# EasyEDA schematic Music Player Module.json
TITLE: Sheet_1; REV: 1.0; Date: 2022-03-27; Sheet: 1/1; Drawn By: confusedtx5; Company: Your Company
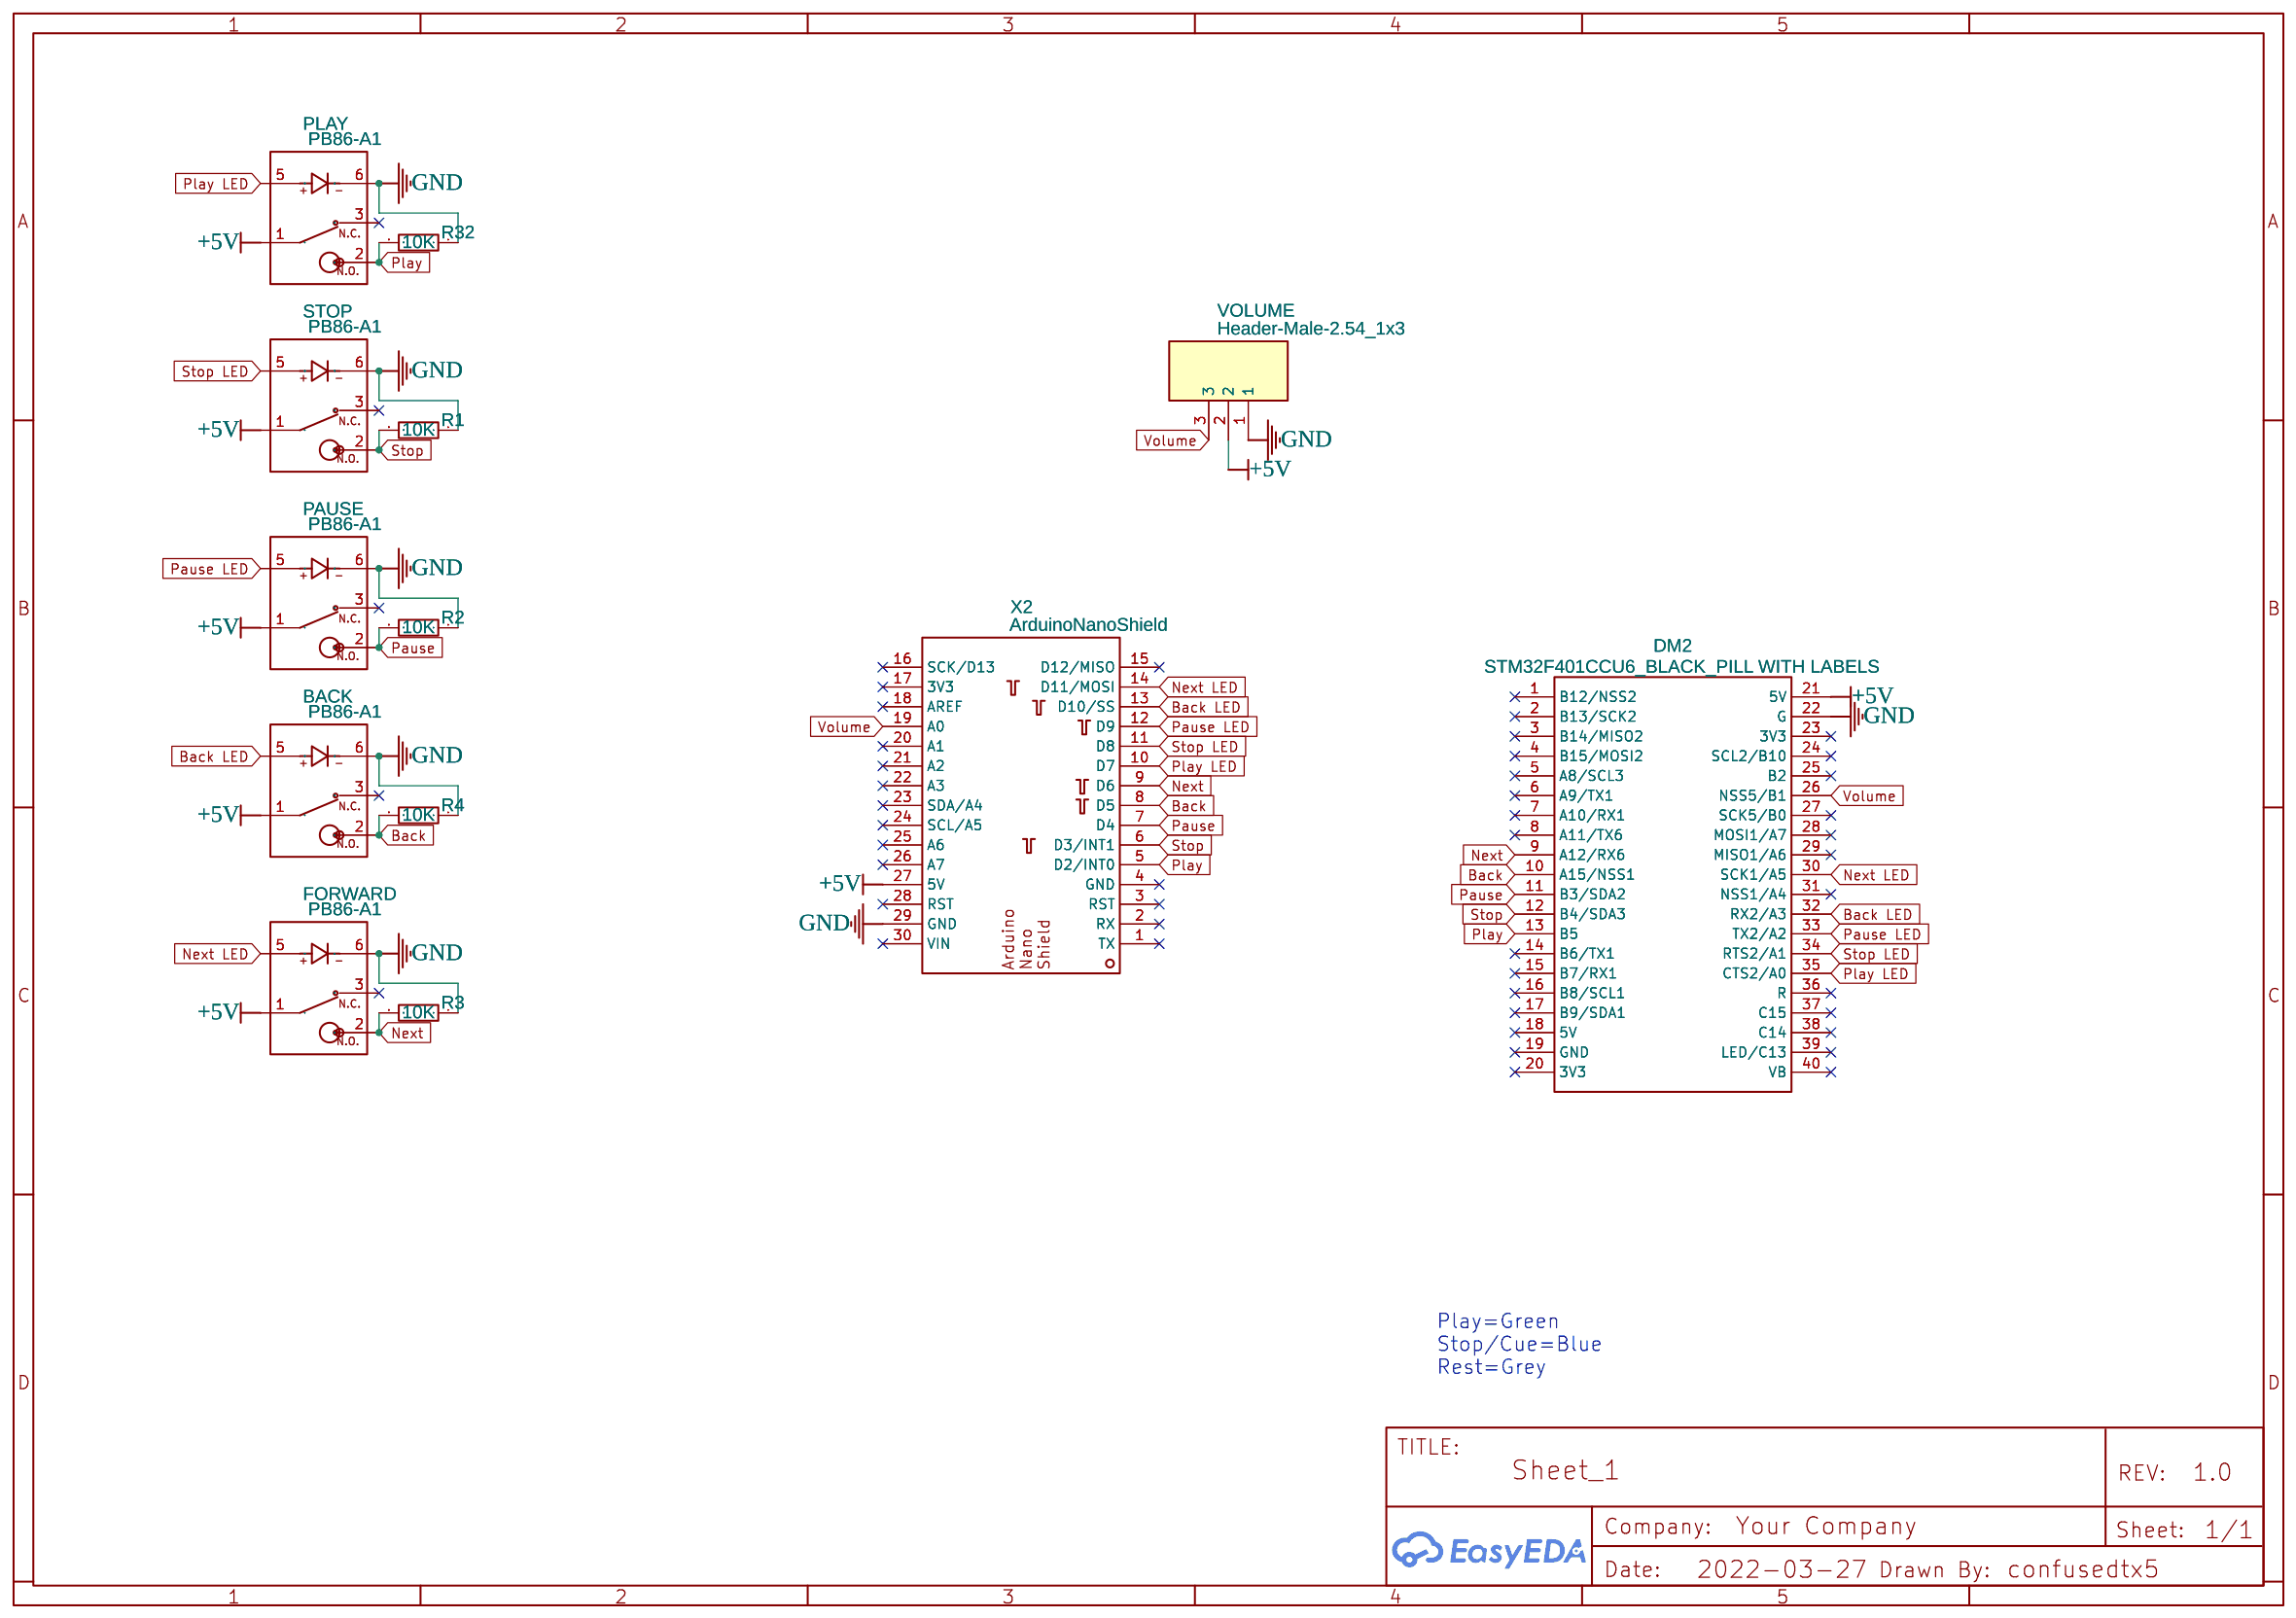
[diagram p0: schematic sheet]

## Parts
BACK  PB86-A1  [PB86-A1]
DM2  STM32F401CCU6_BLACK_PILL WITH LABELS  [STM32F401_BLACK PILL V3_FW]
FORWARD  PB86-A1  [PB86-A1]
PAUSE  PB86-A1  [PB86-A1]
PLAY  PB86-A1  [PB86-A1]
R1  10K  [R0805]
R2  10K  [R0805]
R3  10K  [R0805]
R4  10K  [R0805]
R32  10K  [R0805]
STOP  PB86-A1  [PB86-A1]
VOLUME  Header-Male-2.54_1x3  [HEADER-MALE-2.54_1X3]
X2  ArduinoNanoShield  [ARDUINONANOSHIELD]

## Library data of the parts
BACK FORWARD PAUSE PLAY STOP = PB86-A1: Contributor: ryan_6937
DM2 = STM32F401CCU6_BLACK_PILL WITH LABELS: Contributor: Regela
R1-R4 R32 = ESR03EZPJ103: Supplier: LCSC; Supplier Part: C253330; Manufacturer: ROHM Semicon; Contributor: LCSC; JLCPCB Part Class: Extended Part
VOLUME = Header-Male-2.54_1x3: Manufacturer Part: Header-Male-2.54_1x10
X2 = ArduinoNanoShield: Contributor: BauerTechnology

## Nets
+5V: BACK.1 DM2.21(5V) FORWARD.1 PAUSE.1 PLAY.1 STOP.1 VOLUME.2 X2.27(5V)
GND: BACK.6 DM2.22(G) FORWARD.6 PAUSE.6 PLAY.6 R1.1 R2.1 R3.1 R4.1 R32.1 STOP.6 VOLUME.1 X2.29(GND)
Back: BACK.2 DM2.10(A15/NSS1) R4.2 X2.8(D5)
Back LED: BACK.5 DM2.32(RX2/A3) X2.13(D10/SS)
Next: DM2.9(A12/RX6) FORWARD.2 R3.2 X2.9(D6)
Next LED: DM2.30(SCK1/A5) FORWARD.5 X2.14(D11/MOSI)
Pause: DM2.11(B3/SDA2) PAUSE.2 R2.2 X2.7(D4)
Pause LED: DM2.33(TX2/A2) PAUSE.5 X2.12(D9)
Play: DM2.13(B5) PLAY.2 R32.2 X2.5(D2/INT0)
Play LED: DM2.35(CTS2/A0) PLAY.5 X2.10(D7)
Stop: DM2.12(B4/SDA3) R1.2 STOP.2 X2.6(D3/INT1)
Stop LED: DM2.34(RTS2/A1) STOP.5 X2.11(D8)
Volume: DM2.26(NSS5/B1) VOLUME.3 X2.19(A0)

Not connected (* = marked no-connect by the designer): BACK 3*; DM2 1(B12/NSS2)* 2(B13/SCK2)* 3(B14/MISO2)* 4(B15/MOSI2)* 5(A8/SCL3)* 6(A9/TX1)* 7(A10/RX1)* 8(A11/TX6)* 14(B6/TX1)* 15(B7/RX1)* 16(B8/SCL1)* 17(B9/SDA1)* 18(5V)* 19(GND)* 20(3V3)* 23(3V3)* 24(SCL2/B10)* 25(B2)* 27(SCK5/B0)* 28(MOSI1/A7)* 29(MISO1/A6)* 31(NSS1/A4)* 36(R)* 37(C15)* 38(C14)* 39(LED/C13)* 40(VB)*; FORWARD 3*; PAUSE 3*; PLAY 3*; STOP 3*; X2 1(TX)* 2(RX)* 3(RST)* 4(GND)* 15(D12/MISO)* 16(SCK/D13)* 17(3V3)* 18(AREF)* 20(A1)* 21(A2)* 22(A3)* 23(SDA/A4)* 24(SCL/A5)* 25(A6)* 26(A7)* 28(RST)* 30(VIN)*

## Notes on the sheet
- Play=Green
  Stop/Cue=Blue
  Rest=Grey
